# EAGLE design flip_lamp (EAGLE 7.7.0)
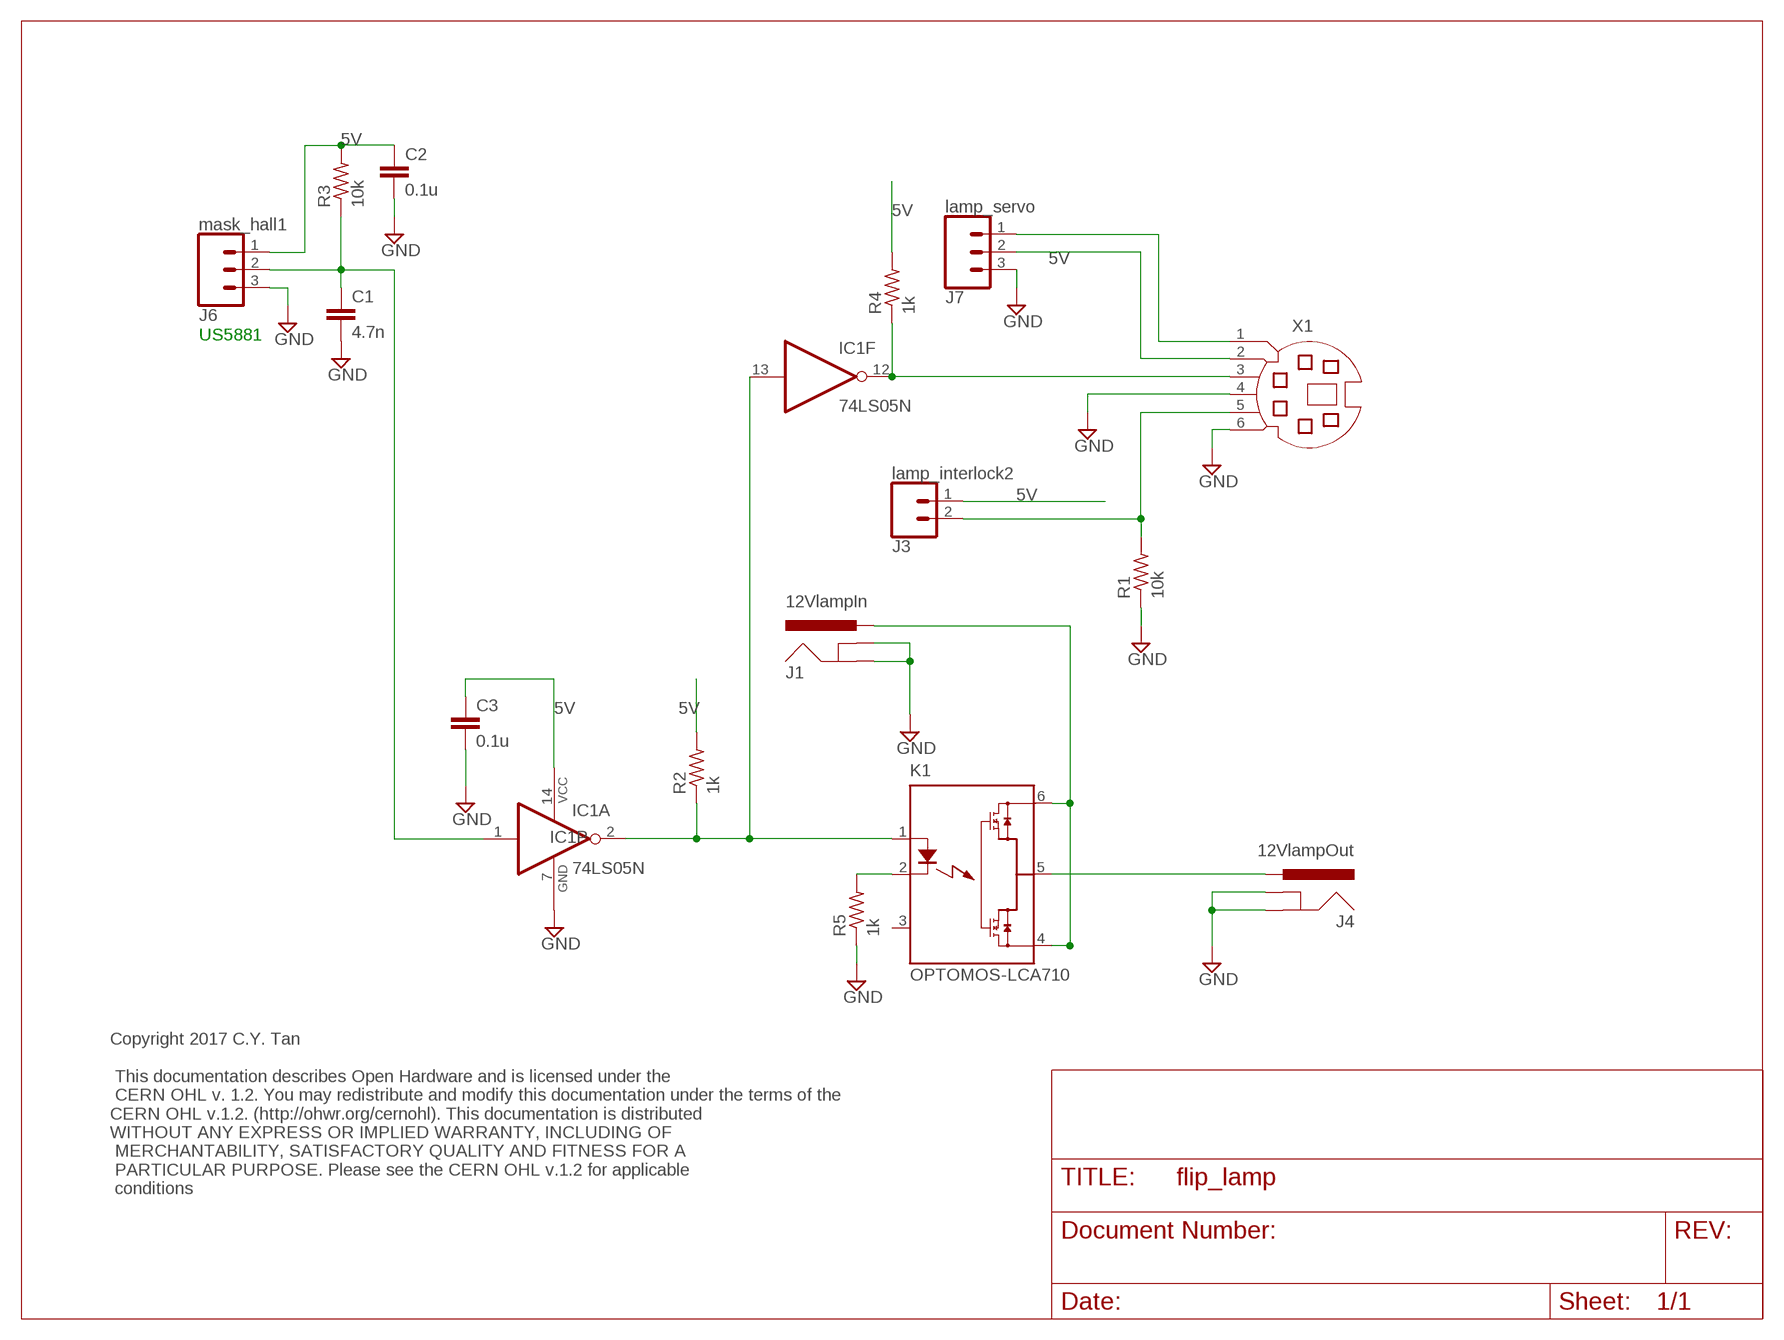
[diagram p0: schematic, sheet 1]

## Parts
C1  4.7n  CAPPTH1  [CAP-PTH-5MM]
C2  0.1u  CAPPTH1  [CAP-PTH-5MM]
C3  0.1u  CAPPTH1  [CAP-PTH-5MM]
IC1  74LS05N  [DIL14]
J1  12VlampIn  POWER_JACK  [POWER_JACK_PTH]
J3  lamp_interlock2  CONN_02  [1X02]
J4  12VlampOut  POWER_JACK  [POWER_JACK_PTH]
J6  mask_hall1  CONN_03  [1X03]
J7  lamp_servo  CONN_03  [1X03]
K1  OPTOMOS-LCA710  [DIL6]
R1  10k  R-US_0207/10  [0207/10]
R2  1k  R-US_0207/10  [0207/10]
R3  10k  R-US_0207/10  [0207/10]
R4  1k  R-US_0207/10  [0207/10]
R5  1k  R-US_0207/10  [0207/10]
X1  MD06SS  [MDIN06SS]

## Nets
5V: C2.1 C3.1 IC1.14(P:VCC) J3.1 J6.1 J7.2 R2.2 R3.2 R4.2 X1.2
GND: C1.2 C2.2 C3.2 IC1.7(P:GND) J1.GND J1.GNDBREAK J4.GND J4.GNDBREAK J6.3 J7.3 R1.1 R5.1 X1.4 X1.6
N$1: IC1.12(F:O) R4.1 X1.3
N$2: J1.PWR K1.4(DS3) K1.6(DS1)
N$3: J4.PWR K1.5(DS2)
N$4: IC1.2(A:O) IC1.13(F:I) K1.1(A) R2.1
N$5: J7.1 X1.1
N$6: J3.2 R1.2 X1.5
N$7: K1.2(K) R5.2
N$8: C1.1 IC1.1(A:I) J6.2 R3.1
Unconnected: IC1.3(B:I) IC1.4(B:O) IC1.5(C:I) IC1.6(C:O) IC1.8(D:O) IC1.9(D:I) IC1.10(E:O) IC1.11(E:I) K1.3(NC)

## Notes on the sheet
- US5881
- Copyright 2017 C.Y. Tan
  
   This documentation describes Open Hardware and is licensed under the
   CERN OHL v. 1.2. You may redistribute and modify this documentation under the terms of the 
  CERN OHL v.1.2. (http://ohwr.org/cernohl). This documentation is distributed 
  WITHOUT ANY EXPRESS OR IMPLIED WARRANTY, INCLUDING OF
   MERCHANTABILITY, SATISFACTORY QUALITY AND FITNESS FOR A
   PARTICULAR PURPOSE. Please see the CERN OHL v.1.2 for applicable
   conditions

## Library data of the parts
C1-C3 = SparkFun-Capacitors:CAP: Capacitor Standard 0603 ceramic capacitor, and 0.1" leaded capacitor.
IC1 = 74xx-us:74*05: Hex INVERTER, open collector
J1 J4 = SparkFun-Connectors:POWER_JACK: Power Jack Connector This is the standard 5.5mm barrel jack for power. The PTH is the most common, proven, reliable, footprint. The Slot footprint only works if the mill layer is transmitted to the PCB fab house so be warned. Here are the connectors we sell at SparkFun: DC Barrel Power Jack/Connector <https://www.sparkfun.com/products/119> (PRT-00119) DC Barrel Power Jack/Connector (SMD) <https://www.sparkfun.com/products/12748> (PRT-12748) DC Barrel Jack Adapter - Breadboard Compatible <https://www.sparkfun.com/products/10811> (PRT-10811) It is used on this SparkFun product (and many, many others): SparkFun RedBoard - Programmed with Arduino <https://www.sparkfun.com/products/12757> (DEV-12757) Also, if you need a mating power supply or connector, please check these out: Wall Adapter Power Supply - 9VDC 650mA <https://www.sparkfun.com/products/298> (TOL-00298) DC Barrel Jack Adapter - Male <https://www.sparkfun.com/products/10287> (PRT-10287); PROD_ID: CONN-08197
J3 = SparkFun-Connectors:CONN_02: Multi connection point. Often used as Generic Header-pin footprint for 0.1 inch spaced/style header connections On any of the 0.1 inch spaced packages, you can populate with these: Break Away Headers - Straight <https://www.sparkfun.com/products/116> (PRT-00116) Break Away Male Headers - Right Angle <https://www.sparkfun.com/products/553> (PRT-00553) Female Headers <https://www.sparkfun.com/products/115> (PRT-00115) Break Away Headers - Machine Pin <https://www.sparkfun.com/products/117> (PRT-00117) Break Away Female Headers - Swiss Machine Pin <https://www.sparkfun.com/products/743> (PRT-00743) For SCREWTERMINALS and SPRING TERMINALS visit here: Screw Terimnals on SparkFun.com <https://www.sparkfun.com/search/results?term=Screw+Terminals> (5mm/3.5mm/2.54mm spacing) This device is also useful as a general connection point to wire up your design to another part of your project. Our various solder wires solder well into these plated through hole pads. Hook-Up Wire - Assortment (Stranded, 22 AWG) <https://www.sparkfun.com/products/11375> (PRT-11375) Hook-Up Wire - Assortment (Solid Core, 22 AWG) <https://www.sparkfun.com/products/11367> (PRT-11367) View the entire wire category on our website here <https://www.sparkfun.com/categories/141> Special notes: Molex polarized connector foot print use with: PRT-08233 with associated crimp pins and housings. 2.54_SCREWTERM for use with PRT-10571. 3.5mm Screw Terminal footprints for PRT-08084 5mm Screw Terminal footprints for use with PRT-08432
J6 J7 = SparkFun-Connectors:CONN_03: Multi connection point. Often used as Generic Header-pin footprint for 0.1 inch spaced/style header connections On any of the 0.1 inch spaced packages, you can populate with these: Break Away Headers - Straight <https://www.sparkfun.com/products/116> (PRT-00116) Break Away Male Headers - Right Angle <https://www.sparkfun.com/products/553> (PRT-00553) Female Headers <https://www.sparkfun.com/products/115> (PRT-00115) Break Away Headers - Machine Pin <https://www.sparkfun.com/products/117> (PRT-00117) Break Away Female Headers - Swiss Machine Pin <https://www.sparkfun.com/products/743> (PRT-00743) Stackable Header - 3 Pin (Female, 0.1") <https://www.sparkfun.com/products/13875> (PRT-13875) For SCREWTERMINALS and SPRING TERMINALS visit here: Screw Terimnals on SparkFun.com <https://www.sparkfun.com/search/results?term=Screw+Terminals> (5mm/3.5mm/2.54mm spacing) This device is also useful as a general connection point to wire up your design to another part of your project. Our various solder wires solder well into these plated through hole pads. Hook-Up Wire - Assortment (Stranded, 22 AWG) <https://www.sparkfun.com/products/11375> (PRT-11375) Hook-Up Wire - Assortment (Solid Core, 22 AWG) <https://www.sparkfun.com/products/11367> (PRT-11367) View the entire wire category on our website here <https://www.sparkfun.com/categories/141> Special notes: Molex polarized connector foot print use with SKU : PRT-08232 with associated crimp pins and housings.
K1 = cytan:OPTOMOS-LCA710: OPTOMOS LC710 is a 60V, 1A, 0.5 ohms 1-Form-A relay
R1-R5 = resistor:R-US_: RESISTOR, American symbol
X1 = con-yamaichi:MD06SS: YAMAICHI CONNECTOR; OC_FARNELL: unknown; OC_NEWARK: unknown

## Board
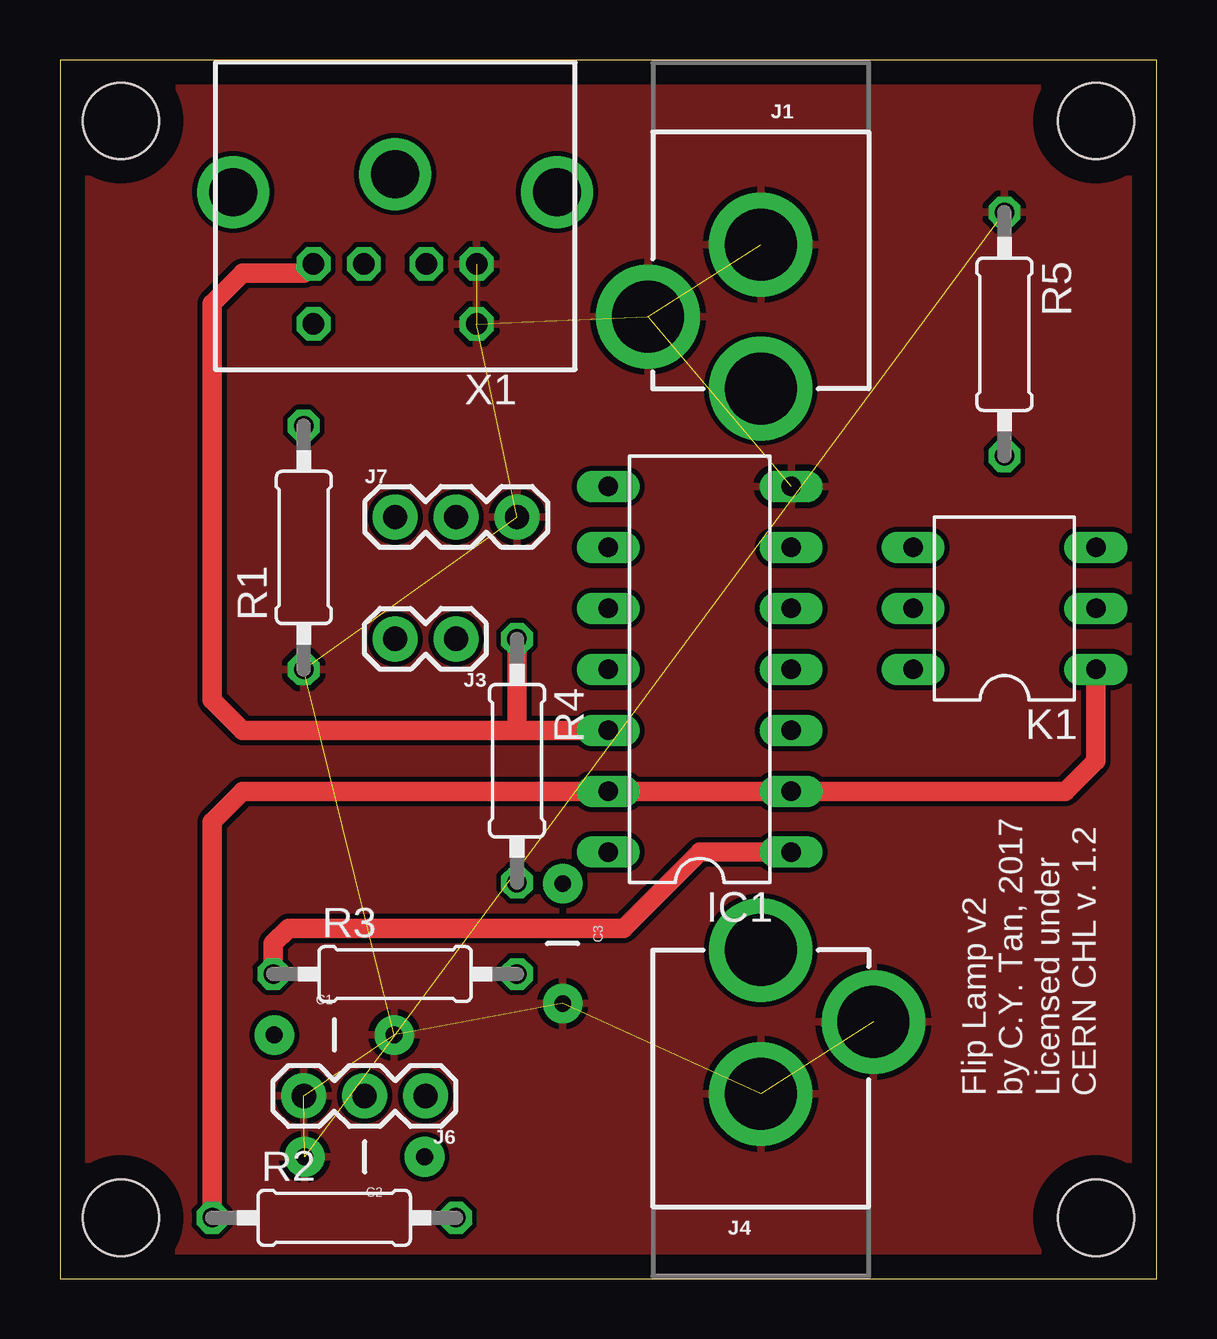
[diagram p1: board, top side]
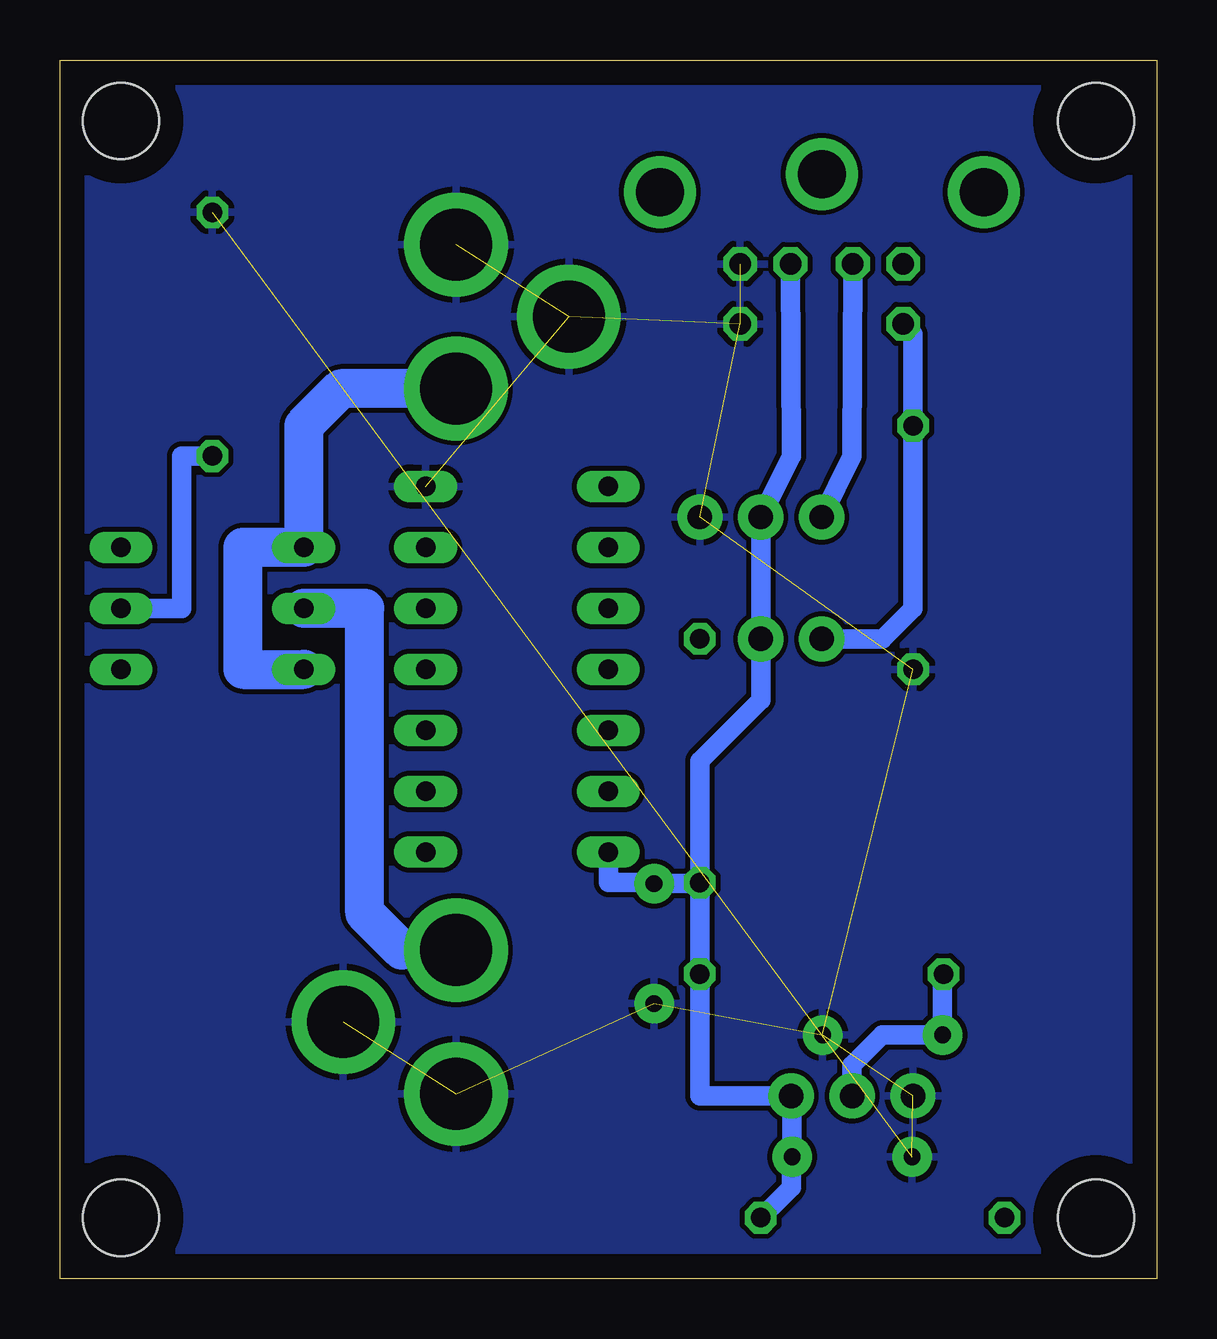
[diagram p2: board, bottom side, seen from below]

Size 45.72 x 50.8 mm. Coordinates in mm from the lower left corner, seen from the top.
Outline: 0,0 45.72,0 45.72,50.8 0,50.8 0,0
Copper layers (1*16): Top 0.035mm / dielectric 1.5mm / Bottom 0.035mm
Design rules "default": minimum track width 10mil, minimum drill 24mil, track to track 8mil, track to pad 8mil, pad to pad 8mil, via to via 8mil, smd to smd 8mil, copper to edge 40mil, drill to drill 8mil, minimum pad ring 10mil, minimum via ring 8mil, stop-mask expansion 4mil, vias tented up to drill 0mil, thermal gap 10mil
Holes 3.17 mm at 2.54,2.54 43.18,48.26 2.54,48.26 43.18,2.54

### Footprints (pad centres in the part's own frame; a part is rotated, then mirrored left to right if it is on the bottom)
CAP-PTH-5MM = drill 0.7 pad 1.651: 1 -2.5,0; 2 2.5,0
DIL14 = drill 0.813 long: 1 -7.62,-3.81; 2 -5.08,-3.81; 3 -2.54,-3.81; 4 0,-3.81; 5 2.54,-3.81; 6 5.08,-3.81; 7 7.62,-3.81; 8 7.62,3.81; 9 5.08,3.81; 10 2.54,3.81; 11 0,3.81; 12 -2.54,3.81; 13 -5.08,3.81; 14 -7.62,3.81
POWER_JACK_PTH = drill 2.997 pad 4.318: GND 0,7.7; GNDBREAK 4.7,10.7; PWR 0,13.7
1X02 = drill 1.016 pad 1.88: 1 0,0; 2 2.54,0
1X03 = drill 1.016 pad 1.88: 1 0,0; 2 2.54,0; 3 5.08,0
DIL6 = drill 0.813 long: 1 -3.81,-3.81; 2 -1.27,-3.81; 3 1.27,-3.81; 4 1.27,3.81; 5 -1.27,3.81; 6 -3.81,3.81
0207/10 = drill 0.813 octagon: 1 -5.08,0; 2 5.08,0
MDIN06SS = drill 0.9 octagon: 1 1.3,8.5; 2 -1.3,8.5; 3 3.4,8.5; 4 -3.4,8.5; 5 3.4,11; 6 -3.4,11 | drill 2: P$1 -6.75,5.5; P$2 0,4.75; P$3 6.75,5.5

### Placement (x,y rotation side)
C1  11.43,10.16 0 top
C2  12.7,5.08 180 top
C3  20.95,13.97 270 top
IC1  26.67,25.4 90 top
J1  29.21,50.8 180 top
J3  16.51,26.67 180 top
J4  29.21,0 0 top
J6  15.24,7.62 180 top
J7  13.97,31.75 0 top
K1  39.37,29.21 90 top
R1  10.16,30.48 90 top
R2  11.43,2.54 0 top
R3  13.97,12.7 0 top
R4  19.05,21.59 270 top
R5  39.37,39.37 270 top
X1  13.97,50.8 180 top

### Tracks (layer width: path | path; a pad name or v marks a point on that pad's centre or on a via)
5V
  Bottom 0.813: X1.2 15.24,34.29 J7.2 J3.1 16.51,24.13 19.05,21.59 R4.2 | R2.2 15.24,3.81 15.24,5.08 C2.1 15.2,7.62 J6.1 19.05,7.62 R3.2 R4.2 | IC1.14 22.86,16.51 21,16.51 C3.1 19.09,16.47 R4.2
GND  (13 unrouted)
  pour Bottom: 0,50.8 0,0 45.72,0 45.72,50.8
  pour Top: 0,50.8 0,0 45.72,0 45.72,50.8
N$1
  Top 0.813: IC1.12 19.05,22.86 | R4.1 19.05,22.86 | 19.05,22.86 7.62,22.86 6.35,24.13 6.35,40.64 7.62,41.91 10.18,41.91 X1.3
N$2
  Bottom 1.626: J1.PWR 34.02,37.1 35.56,35.56 K1.4 38.1,30.48 38.1,25.4 K1.6
N$3
  Bottom 1.626: J4.PWR 31.48,13.7 33.02,15.24 33.02,27.94 K1.5
N$4
  Top 0.813: K1.1 43.18,21.59 41.91,20.32 IC1.2 IC1.13 7.62,20.32 6.35,19.05 R2.1
N$5
  Bottom 0.813: J7.1 12.7,34.29 X1.1
N$6
  Bottom 0.813: X1.5 10.16,39.37 R1.2 10.16,27.94 11.43,26.67 J3.2
N$7
  Bottom 0.813: R5.2 40.64,34.29 40.64,27.94 K1.2
N$8
  Top 0.813: IC1.1 26.67,17.78 23.5,14.61 9.53,14.61 8.89,13.97 R3.1
  Bottom 0.813: R3.1 8.93,12.66 C1.1 11.43,10.16 12.7,8.89 J6.2

### Text on the board
tPlace: Flip Lamp v2 / by C.Y. Tan, 2017 / Licensed under / CERN CHL v. 1.2